# EAGLE schematic Schematic (EAGLE 6.5.0)
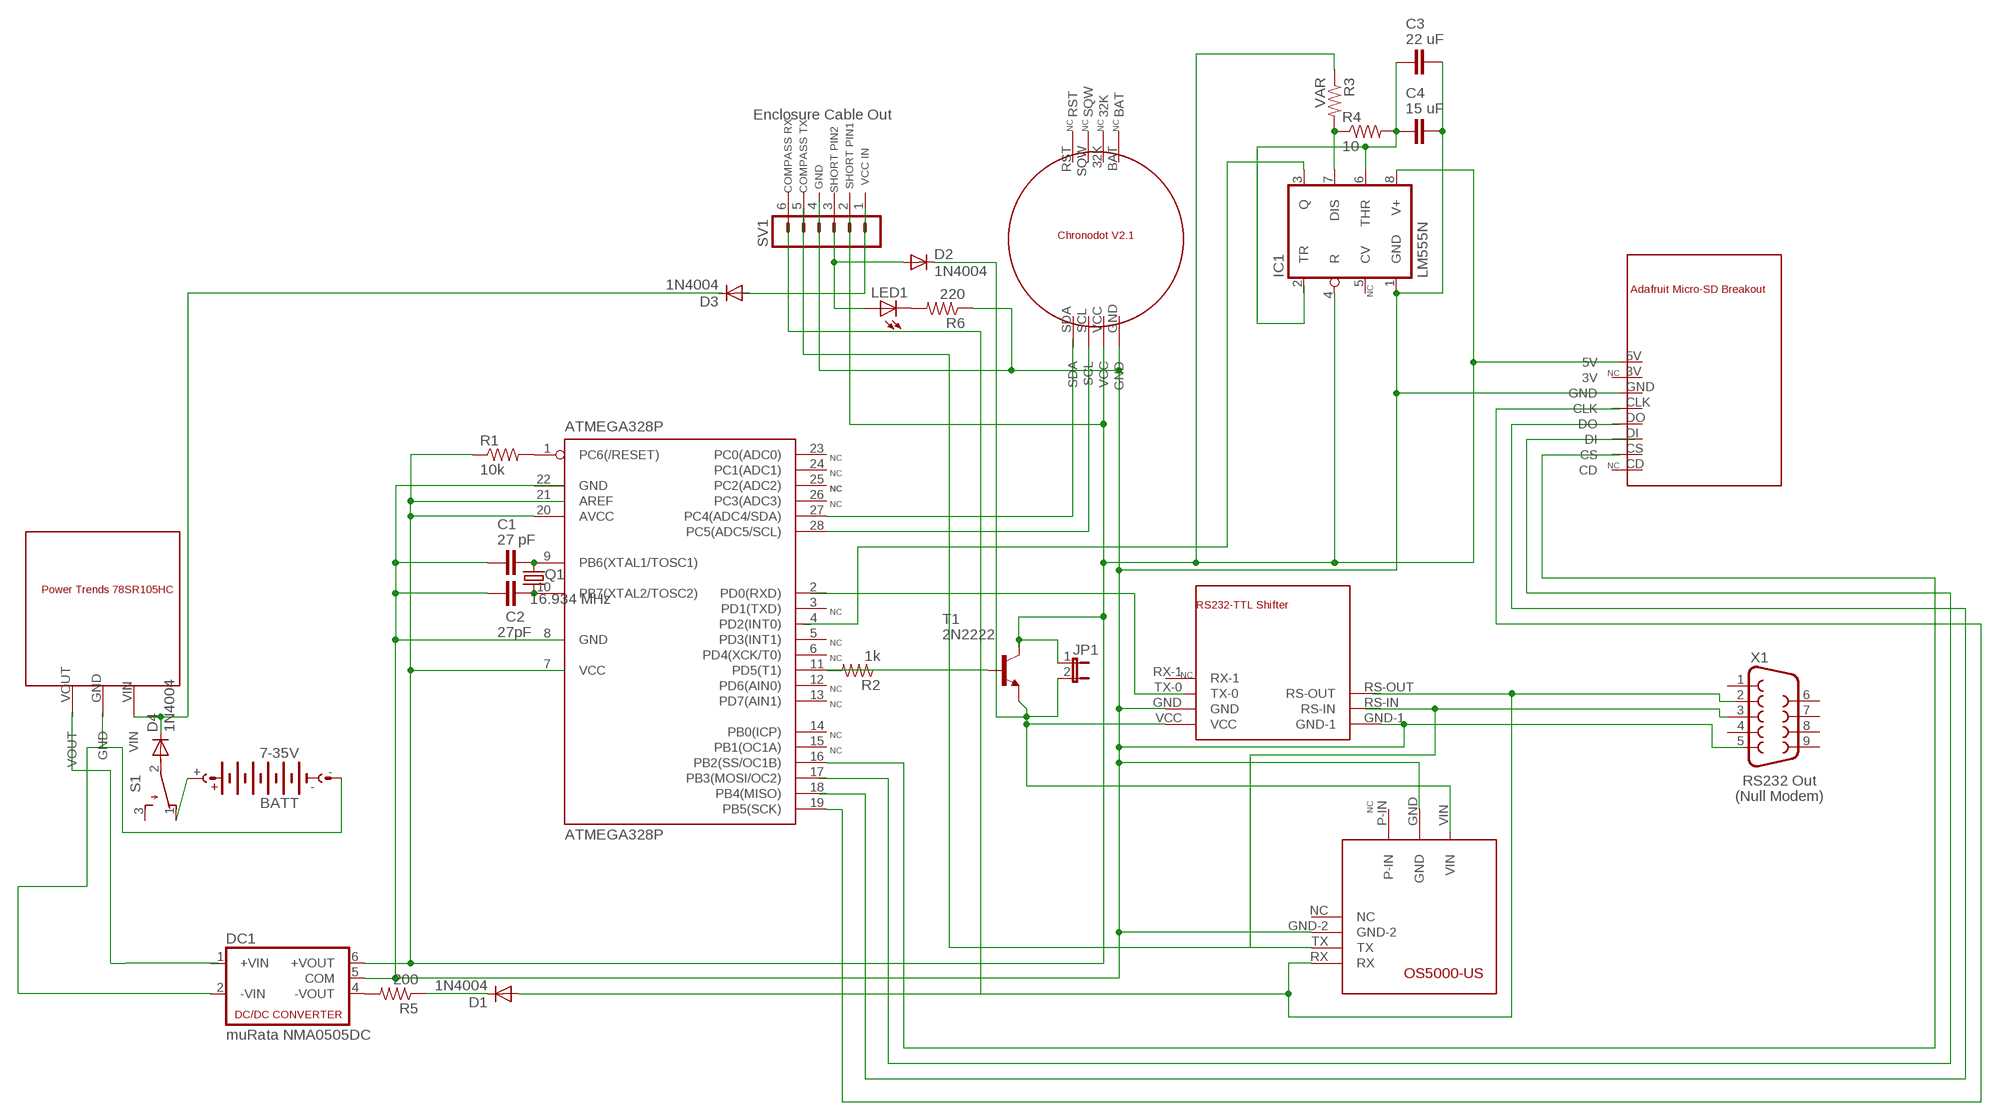
[diagram p0: schematic, sheet 1]

## Parts
ATMEGA328P  ATMEGA328P  MEGA8-P  [DIL28-3]
BATT  7-35V  AB9V  [AB9V]
C1  27 pF  C2,5-3  [C2.5-3]
C2  27pF  C2,5-3  [C2.5-3]
C3  22 uF  C2,5-3  [C2.5-3]
C4  15 uF  C2,5-3  [C2.5-3]
D1  1N4004  [DO41-10]
D2  1N4004  [DO41-10]
D3  1N4004  [DO41-10]
D4  1N4004  [DO41-10]
DC1  muRata NMA0505DC  NMA  [NMA]
IC1  LM555N  [DIL08]
JP1  JP1E  [JP1]
LED1  LAP4-BOTTOM  [P47F-BOTTOM]
Q1  16.934 MHz  FC-12M  [FC-12M]
R1  10k  R-US_0204/5  [0204/5]
R2  1k  R-US_0204/5  [0204/5]
R3  VAR  R-US_0204/5  [0204/5]
R4  10  R-US_0204/5  [0204/5]
R5  200  R-US_0204/5  [0204/5]
R6  220  R-US_0204/5  [0204/5]
S1  TL32PO  [TL3XPO]
SV1  MA06-1  [MA06-1]
T1  2N2222  [TO18]
U$1  OS5000-US  [RS232]
U$2  CHRONODOT  [CHRONODOT]
U$3  ADAFRUIT-SD-BREAKOUT  [ADAFRUIT-SD-BREAKOUT]
U$4  RS232-TTL-SPARKFUN  [RS232-TTL-SPARKFUN]
U$5  POWER_TRENDS_78SR105HC  [POWER_TRENDS_78SR105HC]
X1  F09D  [F09D]

## Nets
N$1: ATMEGA328P.1(PC6(/RESET)) R1.2
N$3: ATMEGA328P.27(PC4(ADC4/SDA))
N$4: DC1.6(+VOUT) IC1.4(R) IC1.8(V+) JP1.1 R1.1 R3.1
N$5: ATMEGA328P.9(PB6(XTAL1/TOSC1)) C1.2 Q1.2
N$6: ATMEGA328P.10(PB7(XTAL2/TOSC2)) C2.2 Q1.1
N$7: ATMEGA328P.28(PC5(ADC5/SCL))
N$8: ATMEGA328P.11(PD5(T1)) R2.1
N$9: R2.2 T1.2(B)
N$11: D2.C JP1.2 T1.1(E) U$4.VCC
N$12: IC1.7(DIS) R3.2 R4.1
N$13: U$1.TX X1.3
N$14: LED1.C R6.2
N$15: C3.1 C4.1 IC1.6(THR) R4.2
N$16: IC1.3(Q)
N$18: ATMEGA328P.19(PB5(SCK))
N$19: D1.A U$1.RX
N$20: ATMEGA328P.16(PB2(SS/OC1B))
N$21: DC1.4(-VOUT) R5.2
N$22: D1.C R5.1
N$23: C1.1 C2.1 C3.2 C4.2 DC1.5(COM) IC1.1(GND) R6.1 U$1.GND U$1.GND-2 U$4.GND U$4.GND-1
N$25: D2.A LED1.A
N$26: D4.C
N$29: BATT.- DC1.2(-VIN)
N$31: BATT.+ S1.1(O)
Unconnected: ATMEGA328P.2(PD0(RXD)) ATMEGA328P.3(PD1(TXD)) ATMEGA328P.4(PD2(INT0)) ATMEGA328P.5(PD3(INT1)) ATMEGA328P.6(PD4(XCK/T0)) ATMEGA328P.12(PD6(AIN0)) ATMEGA328P.13(PD7(AIN1)) ATMEGA328P.14(PB0(ICP)) ATMEGA328P.15(PB1(OC1A)) ATMEGA328P.17(PB3(MOSI/OC2)) ATMEGA328P.18(PB4(MISO)) ATMEGA328P.21(AREF) ATMEGA328P.23(PC0(ADC0)) ATMEGA328P.24(PC1(ADC1)) ATMEGA328P.25(PC2(ADC2)) ATMEGA328P.26(PC3(ADC3)) D3.A D3.C D4.A DC1.1(+VIN) IC1.2(TR) IC1.5(CV) S1.2(P) S1.3(S) SV1.1 SV1.2 SV1.3 SV1.4 SV1.5 SV1.6 T1.3(C) U$1.NC U$1.P-IN U$1.VIN U$2.32K U$2.BAT U$2.GND U$2.RST U$2.SCL U$2.SDA U$2.SQW U$2.VCC U$3.3V U$3.5V U$3.CD U$3.CLK U$3.CS U$3.DI U$3.DO U$3.GND U$4.RS-IN U$4.RS-OUT U$4.RX-1 U$4.TX-0 U$5.GND U$5.VIN U$5.VOUT X1.1 X1.2 X1.4 X1.5 X1.6 X1.7 X1.8 X1.9

## Notes on the sheet
- Enclosure Cable Out
- NC | NC | NC | NC
- VCC IN
- GND | SHORT PIN1
- COMPASS RX | COMPASS TX | SHORT PIN2
- NC
- NC
- NC
- NC
- NC
- NC | NC
- NC
- NC
- NC
- NC
- NC
- NC
- NC
- NC
- NC
- RS232 Out
- (Null Modem)
- NC

## Power pins joined to a net without a drawn wire
AVCC: ATMEGA328P.20(AVCC)
GND: ATMEGA328P.8(GND) ATMEGA328P.22(GND)
VCC: ATMEGA328P.7(VCC)

## Library data of the parts
ATMEGA328P = atmel:MEGA8-P: MICROCONTROLLER 8 Kbytes FLASH, 1 kbytes SRAM, 512 bytes EEPROM, USART, 4-channel 10 bit ADC, 2-channel 8 bit ADC Pin compatible with Atmega48, ATMega88, ATMega168 Source: avr.lbr; OC_FARNELL: unknown; OC_NEWARK: unknown
BATT = battery:AB9V: 9-V BATTERY CLIP
C1-C4 = capacitor-wima:C: CAPACITOR naming: grid - package width
D1-D4 = diode:1N4004: DIODE general purpose rectifier, 1 A
DC1 = dc-dc-converter:NMA: DC-DC CONVERTER; MF: C & D TECHNOLOGIES, INC; MPN: NMA0515SC; OC_FARNELL: 1021434; OC_NEWARK: 61K3064
IC1 = linear:*555: TIMER
JP1 = jumper:JP1E: JUMPER
LED1 = led:*P4: PointLED® Enhanced Thinfilm LED TOP & BOTTOM mount LS P47F, LR P47F, LA P47F, LY P47F, LT P4SG, LB P4SG, LW P4SG Source: http://catalog.osram-os.com .. LA_LR_LS_LY_P47F_Pb_free.pdf
Q1 = crystal:FC-12M: kHz RANGE CRYSTAL UNIT LOW PROFILE SMD Source: Epson Toyocom FC-12M.pdf
R1-R6 = resistor:R-US_: RESISTOR, American symbol
S1 = switch:TL32PO: TINY SWITCH ON - MOM Source: http://www2.produktinfo.conrad.com/datenblaetter/700000-724999/705152-da-01-de-Subminiaturschalter_TL_36YO.pdf
SV1 = con-lstb:MA06-1: PIN HEADER; OC_FARNELL: unknown; OC_NEWARK: unknown
T1 = transistor:2N2222: NPN TRANSISTOR
U$1 = OS5000-US:OS5000-US
U$2 = chronodot:CHRONODOT
U$3 = adafruit-sd-breakout:ADAFRUIT-SD-BREAKOUT
U$4 = RS232-TTL-Sparkfun:RS232-TTL-SPARKFUN
U$5 = POWER_TRENDS_78SR105HC:POWER_TRENDS_78SR105HC
X1 = con-subd:F09: SUB-D; OC_FARNELL: unknown; OC_NEWARK: unknown